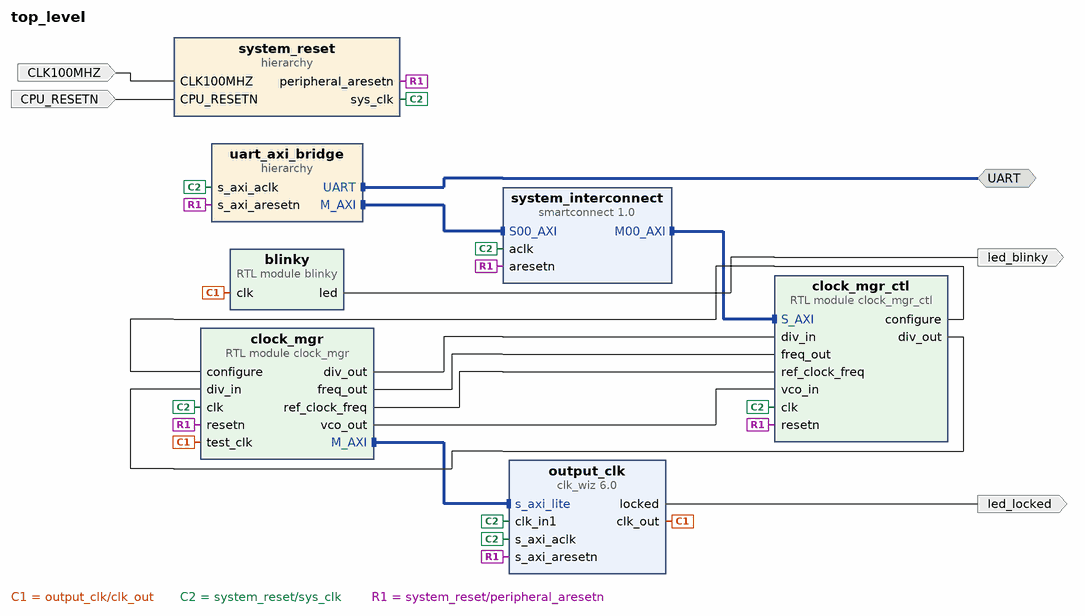
[diagram p0: block diagram of the top level]
# Vivado block design top_level, xc7a100tcsg324-1, Vivado 2021.1
create_bd_design top_level

create_bd_intf_port -mode Master -vlnv xilinx.com:interface:uart_rtl:1.0 UART
create_bd_port -dir I -type clk CLK100MHZ
create_bd_port -dir I -type rst CPU_RESETN
create_bd_port -dir O led_locked
create_bd_port -dir O led_blinky

create_bd_cell -type hier uart_axi_bridge
create_bd_cell -type ip -vlnv xilinx.com:ip:smartconnect:1.0 system_interconnect
set_property -dict {CONFIG.NUM_MI 1 CONFIG.NUM_SI 1} [get_bd_cells system_interconnect]
create_bd_cell -type module -reference blinky blinky
create_bd_cell -type hier system_reset
create_bd_cell -type ip -vlnv xilinx.com:ip:clk_wiz:6.0 output_clk
set_property -dict [list \
  CONFIG.CLKOUT1_JITTER 137.143 \
  CONFIG.CLKOUT1_REQUESTED_OUT_FREQ 80 \
  CONFIG.CLK_OUT1_PORT clk_out \
  CONFIG.MMCM_CLKOUT0_DIVIDE_F 12.500 \
  CONFIG.PRIM_SOURCE No_buffer \
  CONFIG.USE_DYN_RECONFIG true \
] [get_bd_cells output_clk]
create_bd_cell -type module -reference clock_mgr_ctl clock_mgr_ctl
create_bd_cell -type module -reference clock_mgr clock_mgr
set_property -dict {CONFIG.FREQ_HZ 100000000} [get_bd_cells clock_mgr]

# ---- hierarchy /uart_axi_bridge ----
current_bd_instance /uart_axi_bridge
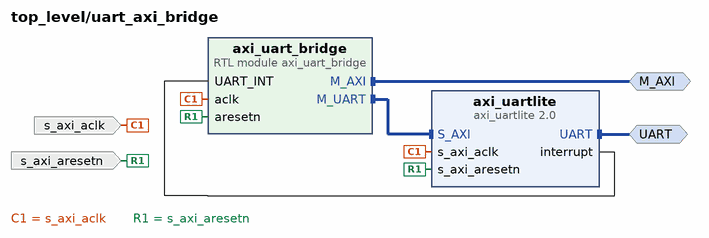
[diagram p1: block diagram inside /uart_axi_bridge]
create_bd_intf_pin -mode Master -vlnv xilinx.com:interface:uart_rtl:1.0 UART
create_bd_intf_pin -mode Master -vlnv xilinx.com:interface:aximm_rtl:1.0 M_AXI
create_bd_pin -dir I -type clk s_axi_aclk
create_bd_pin -dir I -type rst s_axi_aresetn

create_bd_cell -type module -reference axi_uart_bridge axi_uart_bridge
create_bd_cell -type ip -vlnv xilinx.com:ip:axi_uartlite:2.0 axi_uartlite
set_property -dict {CONFIG.C_BAUDRATE 115200} [get_bd_cells axi_uartlite]

# ---- hierarchy /system_reset ----
current_bd_instance /system_reset
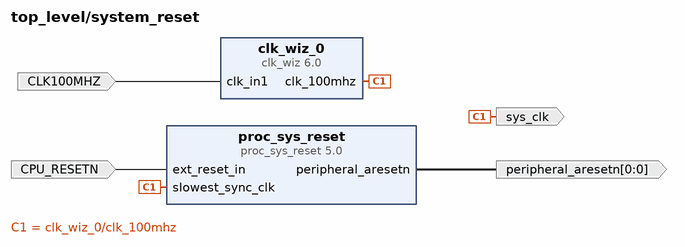
[diagram p2: block diagram inside /system_reset]
create_bd_pin -dir I -type rst CPU_RESETN
create_bd_pin -dir O -from 0 -to 0 -type rst peripheral_aresetn
create_bd_pin -dir I -type clk CLK100MHZ
create_bd_pin -dir O -type clk sys_clk

create_bd_cell -type ip -vlnv xilinx.com:ip:proc_sys_reset:5.0 proc_sys_reset
create_bd_cell -type ip -vlnv xilinx.com:ip:clk_wiz:6.0 clk_wiz_0
set_property -dict [list \
  CONFIG.AXI_DRP false \
  CONFIG.CLKOUT2_JITTER 130.958 \
  CONFIG.CLKOUT2_PHASE_ERROR 98.575 \
  CONFIG.CLKOUT2_USED false \
  CONFIG.CLK_OUT1_PORT clk_100mhz \
  CONFIG.CLK_OUT2_PORT clk_100mhz \
  CONFIG.MMCM_CLKOUT1_DIVIDE 1 \
  CONFIG.NUM_OUT_CLKS 1 \
  CONFIG.PHASE_DUTY_CONFIG false \
  CONFIG.USE_DYN_RECONFIG false \
  CONFIG.USE_LOCKED false \
  CONFIG.USE_RESET false \
] [get_bd_cells clk_wiz_0]

# ---- connections ----

current_bd_instance /uart_axi_bridge
connect_bd_intf_net [get_bd_intf_pins M_AXI] [get_bd_intf_pins axi_uart_bridge/M_AXI]
connect_bd_intf_net [get_bd_intf_pins axi_uart_bridge/M_UART] [get_bd_intf_pins axi_uartlite/S_AXI]
connect_bd_intf_net [get_bd_intf_pins UART] [get_bd_intf_pins axi_uartlite/UART]
connect_bd_net [get_bd_pins axi_uartlite/interrupt] [get_bd_pins axi_uart_bridge/UART_INT]
connect_bd_net -net source_100mhz_sys_clk [get_bd_pins s_axi_aclk] [get_bd_pins axi_uartlite/s_axi_aclk] [get_bd_pins axi_uart_bridge/aclk]
connect_bd_net -net source_100mhz_sys_resetn [get_bd_pins s_axi_aresetn] \
  [get_bd_pins axi_uartlite/s_axi_aresetn] [get_bd_pins axi_uart_bridge/aresetn]

current_bd_instance /system_reset
connect_bd_net [get_bd_pins CLK100MHZ] [get_bd_pins clk_wiz_0/clk_in1]
connect_bd_net [get_bd_pins CPU_RESETN] [get_bd_pins proc_sys_reset/ext_reset_in]
connect_bd_net [get_bd_pins clk_wiz_0/clk_100mhz] [get_bd_pins proc_sys_reset/slowest_sync_clk] [get_bd_pins sys_clk]
connect_bd_net -net source_100mhz_sys_resetn [get_bd_pins proc_sys_reset/peripheral_aresetn] [get_bd_pins peripheral_aresetn]

current_bd_instance /
connect_bd_intf_net -intf_net axi_uartlite_UART [get_bd_intf_ports UART] [get_bd_intf_pins uart_axi_bridge/UART]
connect_bd_intf_net -intf_net clock_mgr_0_M_AXI [get_bd_intf_pins clock_mgr/M_AXI] [get_bd_intf_pins output_clk/s_axi_lite]
connect_bd_intf_net [get_bd_intf_pins clock_mgr_ctl/S_AXI] [get_bd_intf_pins system_interconnect/M00_AXI]
connect_bd_intf_net [get_bd_intf_pins uart_axi_bridge/M_AXI] [get_bd_intf_pins system_interconnect/S00_AXI]
connect_bd_net [get_bd_ports CLK100MHZ] [get_bd_pins system_reset/CLK100MHZ]
connect_bd_net [get_bd_ports CPU_RESETN] [get_bd_pins system_reset/CPU_RESETN]
connect_bd_net [get_bd_pins blinky/led] [get_bd_ports led_blinky]
connect_bd_net -net clk_wiz_1_locked [get_bd_pins output_clk/locked] [get_bd_ports led_locked]
connect_bd_net -net clock_mgr_ctl_0_configure [get_bd_pins clock_mgr_ctl/configure] [get_bd_pins clock_mgr/configure]
connect_bd_net -net clock_mgr_ctl_0_div_out [get_bd_pins clock_mgr_ctl/div_out] [get_bd_pins clock_mgr/div_in]
connect_bd_net [get_bd_pins clock_mgr/div_out] [get_bd_pins clock_mgr_ctl/div_in]
connect_bd_net [get_bd_pins clock_mgr/freq_out] [get_bd_pins clock_mgr_ctl/freq_out]
connect_bd_net [get_bd_pins clock_mgr/ref_clock_freq] [get_bd_pins clock_mgr_ctl/ref_clock_freq]
connect_bd_net [get_bd_pins clock_mgr/vco_out] [get_bd_pins clock_mgr_ctl/vco_in]
connect_bd_net [get_bd_pins output_clk/clk_out] [get_bd_pins blinky/clk] [get_bd_pins clock_mgr/test_clk]
connect_bd_net -net source_100mhz_sys_clk [get_bd_pins system_reset/sys_clk] \
  [get_bd_pins uart_axi_bridge/s_axi_aclk] [get_bd_pins system_interconnect/aclk] [get_bd_pins output_clk/s_axi_aclk] \
  [get_bd_pins output_clk/clk_in1] [get_bd_pins clock_mgr_ctl/clk] [get_bd_pins clock_mgr/clk]
connect_bd_net -net source_100mhz_sys_resetn [get_bd_pins system_reset/peripheral_aresetn] \
  [get_bd_pins uart_axi_bridge/s_axi_aresetn] [get_bd_pins system_interconnect/aresetn] \
  [get_bd_pins output_clk/s_axi_aresetn] [get_bd_pins clock_mgr_ctl/resetn] [get_bd_pins clock_mgr/resetn]

# ---- address map ----
assign_bd_address -offset 0x000 -range 4K -target_address_space [get_bd_addr_spaces clock_mgr/M_AXI] [get_bd_addr_segs output_clk/s_axi_lite/Reg]
assign_bd_address -offset 0x0000000000001000 -range 4K -target_address_space [get_bd_addr_spaces uart_axi_bridge/axi_uart_bridge/M_AXI] [get_bd_addr_segs clock_mgr_ctl/S_AXI/reg0]
assign_bd_address -offset 0x40600000 -range 64K -target_address_space [get_bd_addr_spaces uart_axi_bridge/axi_uart_bridge/M_UART] [get_bd_addr_segs uart_axi_bridge/axi_uartlite/S_AXI/Reg]

validate_bd_design
save_bd_design
